# EAGLE design BBMiniPCB5x10 (EAGLE 6.6.0)
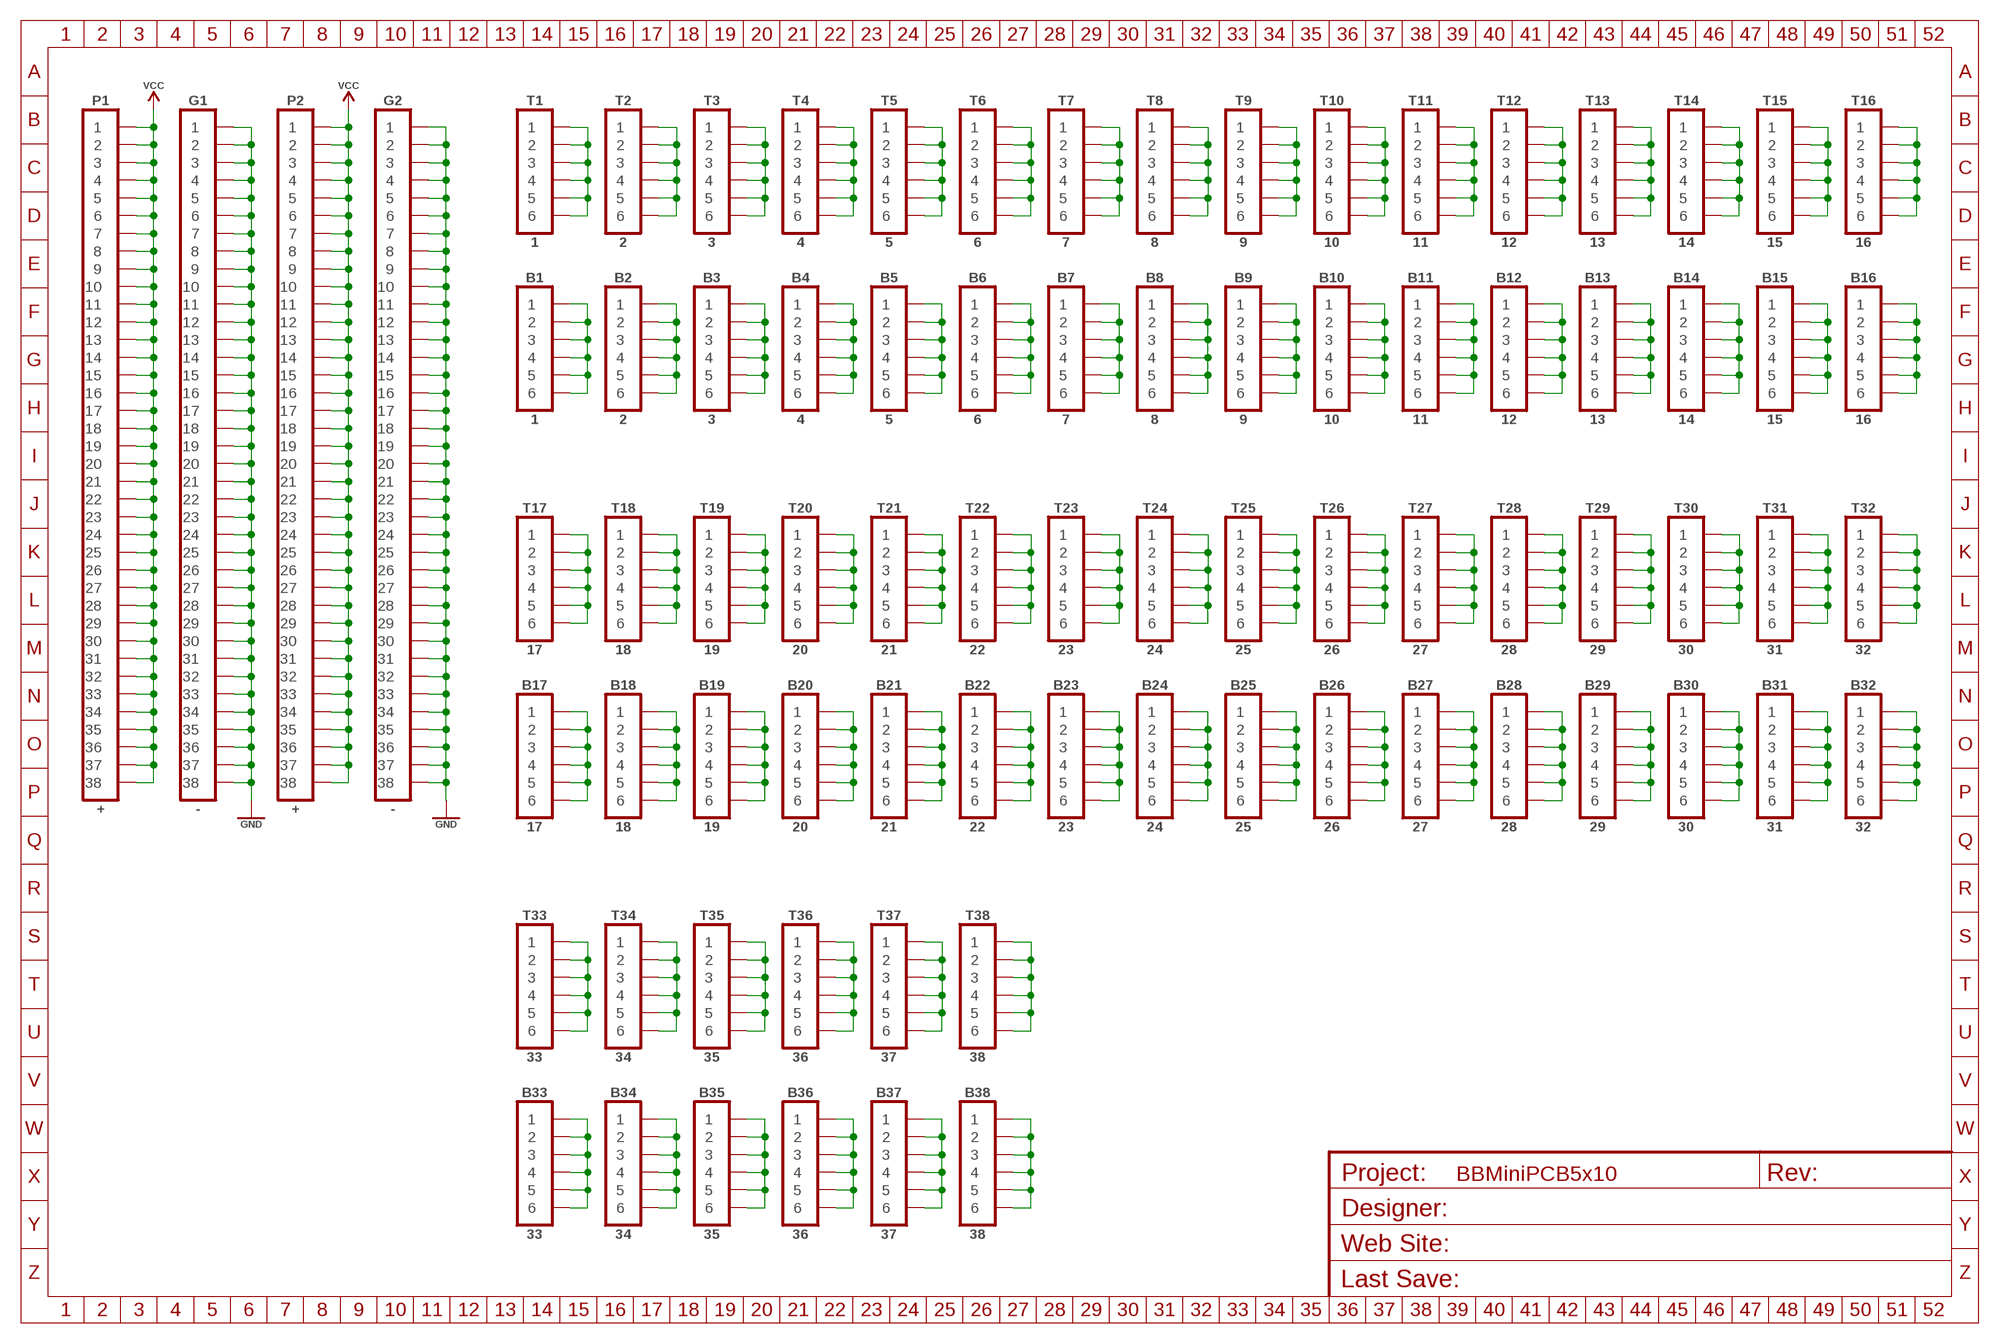
[diagram p0: schematic, sheet 1]
FRAME1 (A4L_FRAME): DESIGNER: Simon/CGTr; REVISION: 1.0; WEBSITE: http://www.commodore.gen.tr

## Parts
B1  1  HDR_1X06_NOSILK  [HDR_1X06_NOSILK]
B2  2  HDR_1X06_NOSILK  [HDR_1X06_NOSILK]
B3  3  HDR_1X06_NOSILK  [HDR_1X06_NOSILK]
B4  4  HDR_1X06_NOSILK  [HDR_1X06_NOSILK]
B5  5  HDR_1X06_NOSILK  [HDR_1X06_NOSILK]
B6  6  HDR_1X06_NOSILK  [HDR_1X06_NOSILK]
B7  7  HDR_1X06_NOSILK  [HDR_1X06_NOSILK]
B8  8  HDR_1X06_NOSILK  [HDR_1X06_NOSILK]
B9  9  HDR_1X06_NOSILK  [HDR_1X06_NOSILK]
B10  10  HDR_1X06_NOSILK  [HDR_1X06_NOSILK]
B11  11  HDR_1X06_NOSILK  [HDR_1X06_NOSILK]
B12  12  HDR_1X06_NOSILK  [HDR_1X06_NOSILK]
B13  13  HDR_1X06_NOSILK  [HDR_1X06_NOSILK]
B14  14  HDR_1X06_NOSILK  [HDR_1X06_NOSILK]
B15  15  HDR_1X06_NOSILK  [HDR_1X06_NOSILK]
B16  16  HDR_1X06_NOSILK  [HDR_1X06_NOSILK]
B17  17  HDR_1X06_NOSILK  [HDR_1X06_NOSILK]
B18  18  HDR_1X06_NOSILK  [HDR_1X06_NOSILK]
B19  19  HDR_1X06_NOSILK  [HDR_1X06_NOSILK]
B20  20  HDR_1X06_NOSILK  [HDR_1X06_NOSILK]
B21  21  HDR_1X06_NOSILK  [HDR_1X06_NOSILK]
B22  22  HDR_1X06_NOSILK  [HDR_1X06_NOSILK]
B23  23  HDR_1X06_NOSILK  [HDR_1X06_NOSILK]
B24  24  HDR_1X06_NOSILK  [HDR_1X06_NOSILK]
B25  25  HDR_1X06_NOSILK  [HDR_1X06_NOSILK]
B26  26  HDR_1X06_NOSILK  [HDR_1X06_NOSILK]
B27  27  HDR_1X06_NOSILK  [HDR_1X06_NOSILK]
B28  28  HDR_1X06_NOSILK  [HDR_1X06_NOSILK]
B29  29  HDR_1X06_NOSILK  [HDR_1X06_NOSILK]
B30  30  HDR_1X06_NOSILK  [HDR_1X06_NOSILK]
B31  31  HDR_1X06_NOSILK  [HDR_1X06_NOSILK]
B32  32  HDR_1X06_NOSILK  [HDR_1X06_NOSILK]
B33  33  HDR_1X06_NOSILK  [HDR_1X06_NOSILK]
B34  34  HDR_1X06_NOSILK  [HDR_1X06_NOSILK]
B35  35  HDR_1X06_NOSILK  [HDR_1X06_NOSILK]
B36  36  HDR_1X06_NOSILK  [HDR_1X06_NOSILK]
B37  37  HDR_1X06_NOSILK  [HDR_1X06_NOSILK]
B38  38  HDR_1X06_NOSILK  [HDR_1X06_NOSILK]
G1  -  HDR_1X38_NOSILK  [HDR_1X38_NOSILK]
G2  -  HDR_1X38_NOSILK  [HDR_1X38_NOSILK]
P1  +  HDR_1X38_NOSILK  [HDR_1X38_NOSILK]
P2  +  HDR_1X38_NOSILK  [HDR_1X38_NOSILK]
T1  1  HDR_1X06_NOSILK  [HDR_1X06_NOSILK]
T2  2  HDR_1X06_NOSILK  [HDR_1X06_NOSILK]
T3  3  HDR_1X06_NOSILK  [HDR_1X06_NOSILK]
T4  4  HDR_1X06_NOSILK  [HDR_1X06_NOSILK]
T5  5  HDR_1X06_NOSILK  [HDR_1X06_NOSILK]
T6  6  HDR_1X06_NOSILK  [HDR_1X06_NOSILK]
T7  7  HDR_1X06_NOSILK  [HDR_1X06_NOSILK]
T8  8  HDR_1X06_NOSILK  [HDR_1X06_NOSILK]
T9  9  HDR_1X06_NOSILK  [HDR_1X06_NOSILK]
T10  10  HDR_1X06_NOSILK  [HDR_1X06_NOSILK]
T11  11  HDR_1X06_NOSILK  [HDR_1X06_NOSILK]
T12  12  HDR_1X06_NOSILK  [HDR_1X06_NOSILK]
T13  13  HDR_1X06_NOSILK  [HDR_1X06_NOSILK]
T14  14  HDR_1X06_NOSILK  [HDR_1X06_NOSILK]
T15  15  HDR_1X06_NOSILK  [HDR_1X06_NOSILK]
T16  16  HDR_1X06_NOSILK  [HDR_1X06_NOSILK]
T17  17  HDR_1X06_NOSILK  [HDR_1X06_NOSILK]
T18  18  HDR_1X06_NOSILK  [HDR_1X06_NOSILK]
T19  19  HDR_1X06_NOSILK  [HDR_1X06_NOSILK]
T20  20  HDR_1X06_NOSILK  [HDR_1X06_NOSILK]
T21  21  HDR_1X06_NOSILK  [HDR_1X06_NOSILK]
T22  22  HDR_1X06_NOSILK  [HDR_1X06_NOSILK]
T23  23  HDR_1X06_NOSILK  [HDR_1X06_NOSILK]
T24  24  HDR_1X06_NOSILK  [HDR_1X06_NOSILK]
T25  25  HDR_1X06_NOSILK  [HDR_1X06_NOSILK]
T26  26  HDR_1X06_NOSILK  [HDR_1X06_NOSILK]
T27  27  HDR_1X06_NOSILK  [HDR_1X06_NOSILK]
T28  28  HDR_1X06_NOSILK  [HDR_1X06_NOSILK]
T29  29  HDR_1X06_NOSILK  [HDR_1X06_NOSILK]
T30  30  HDR_1X06_NOSILK  [HDR_1X06_NOSILK]
T31  31  HDR_1X06_NOSILK  [HDR_1X06_NOSILK]
T32  32  HDR_1X06_NOSILK  [HDR_1X06_NOSILK]
T33  33  HDR_1X06_NOSILK  [HDR_1X06_NOSILK]
T34  34  HDR_1X06_NOSILK  [HDR_1X06_NOSILK]
T35  35  HDR_1X06_NOSILK  [HDR_1X06_NOSILK]
T36  36  HDR_1X06_NOSILK  [HDR_1X06_NOSILK]
T37  37  HDR_1X06_NOSILK  [HDR_1X06_NOSILK]
T38  38  HDR_1X06_NOSILK  [HDR_1X06_NOSILK]

## Nets
B1: B1.1 B1.2 B1.3 B1.4 B1.5 B1.6
B2: B2.1 B2.2 B2.3 B2.4 B2.5 B2.6
B3: B3.1 B3.2 B3.3 B3.4 B3.5 B3.6
B4: B4.1 B4.2 B4.3 B4.4 B4.5 B4.6
B5: B5.1 B5.2 B5.3 B5.4 B5.5 B5.6
B6: B6.1 B6.2 B6.3 B6.4 B6.5 B6.6
B7: B7.1 B7.2 B7.3 B7.4 B7.5 B7.6
B8: B8.1 B8.2 B8.3 B8.4 B8.5 B8.6
B9: B9.1 B9.2 B9.3 B9.4 B9.5 B9.6
B10: B10.1 B10.2 B10.3 B10.4 B10.5 B10.6
B11: B11.1 B11.2 B11.3 B11.4 B11.5 B11.6
B12: B12.1 B12.2 B12.3 B12.4 B12.5 B12.6
B13: B13.1 B13.2 B13.3 B13.4 B13.5 B13.6
B14: B14.1 B14.2 B14.3 B14.4 B14.5 B14.6
B15: B15.1 B15.2 B15.3 B15.4 B15.5 B15.6
B16: B16.1 B16.2 B16.3 B16.4 B16.5 B16.6
B17: B17.1 B17.2 B17.3 B17.4 B17.5 B17.6
B18: B18.1 B18.2 B18.3 B18.4 B18.5 B18.6
B19: B19.1 B19.2 B19.3 B19.4 B19.5 B19.6
B20: B20.1 B20.2 B20.3 B20.4 B20.5 B20.6
B21: B21.1 B21.2 B21.3 B21.4 B21.5 B21.6
B22: B22.1 B22.2 B22.3 B22.4 B22.5 B22.6
B23: B23.1 B23.2 B23.3 B23.4 B23.5 B23.6
B24: B24.1 B24.2 B24.3 B24.4 B24.5 B24.6
B25: B25.1 B25.2 B25.3 B25.4 B25.5 B25.6
B26: B26.1 B26.2 B26.3 B26.4 B26.5 B26.6
B27: B27.1 B27.2 B27.3 B27.4 B27.5 B27.6
B28: B28.1 B28.2 B28.3 B28.4 B28.5 B28.6
B29: B29.1 B29.2 B29.3 B29.4 B29.5 B29.6
B30: B30.1 B30.2 B30.3 B30.4 B30.5 B30.6
B31: B31.1 B31.2 B31.3 B31.4 B31.5 B31.6
B32: B32.1 B32.2 B32.3 B32.4 B32.5 B32.6
B33: B33.1 B33.2 B33.3 B33.4 B33.5 B33.6
B34: B34.1 B34.2 B34.3 B34.4 B34.5 B34.6
B35: B35.1 B35.2 B35.3 B35.4 B35.5 B35.6
B36: B36.1 B36.2 B36.3 B36.4 B36.5 B36.6
B37: B37.1 B37.2 B37.3 B37.4 B37.5 B37.6
B38: B38.1 B38.2 B38.3 B38.4 B38.5 B38.6
GND: G1.1 G1.2 G1.3 G1.4 G1.5 G1.6 G1.7 G1.8 G1.9 G1.10 G1.11 G1.12 G1.13 G1.14 G1.15 G1.16 G1.17 G1.18 G1.19 G1.20 G1.21 G1.22 G1.23 G1.24 G1.25 G1.26 G1.27 G1.28 G1.29 G1.30 G1.31 G1.32 G1.33 G1.34 G1.35 G1.36 G1.37 G1.38 G2.1 G2.2 G2.3 G2.4 G2.5 G2.6 G2.7 G2.8 G2.9 G2.10 G2.11 G2.12 G2.13 G2.14 G2.15 G2.16 G2.17 G2.18 G2.19 G2.20 G2.21 G2.22 G2.23 G2.24 G2.25 G2.26 G2.27 G2.28 G2.29 G2.30 G2.31 G2.32 G2.33 G2.34 G2.35 G2.36 G2.37 G2.38
T1: T1.1 T1.2 T1.3 T1.4 T1.5 T1.6
T2: T2.1 T2.2 T2.3 T2.4 T2.5 T2.6
T3: T3.1 T3.2 T3.3 T3.4 T3.5 T3.6
T4: T4.1 T4.2 T4.3 T4.4 T4.5 T4.6
T5: T5.1 T5.2 T5.3 T5.4 T5.5 T5.6
T6: T6.1 T6.2 T6.3 T6.4 T6.5 T6.6
T7: T7.1 T7.2 T7.3 T7.4 T7.5 T7.6
T8: T8.1 T8.2 T8.3 T8.4 T8.5 T8.6
T9: T9.1 T9.2 T9.3 T9.4 T9.5 T9.6
T10: T10.1 T10.2 T10.3 T10.4 T10.5 T10.6
T11: T11.1 T11.2 T11.3 T11.4 T11.5 T11.6
T12: T12.1 T12.2 T12.3 T12.4 T12.5 T12.6
T13: T13.1 T13.2 T13.3 T13.4 T13.5 T13.6
T14: T14.1 T14.2 T14.3 T14.4 T14.5 T14.6
T15: T15.1 T15.2 T15.3 T15.4 T15.5 T15.6
T16: T16.1 T16.2 T16.3 T16.4 T16.5 T16.6
T17: T17.1 T17.2 T17.3 T17.4 T17.5 T17.6
T18: T18.1 T18.2 T18.3 T18.4 T18.5 T18.6
T19: T19.1 T19.2 T19.3 T19.4 T19.5 T19.6
T20: T20.1 T20.2 T20.3 T20.4 T20.5 T20.6
T21: T21.1 T21.2 T21.3 T21.4 T21.5 T21.6
T22: T22.1 T22.2 T22.3 T22.4 T22.5 T22.6
T23: T23.1 T23.2 T23.3 T23.4 T23.5 T23.6
T24: T24.1 T24.2 T24.3 T24.4 T24.5 T24.6
T25: T25.1 T25.2 T25.3 T25.4 T25.5 T25.6
T26: T26.1 T26.2 T26.3 T26.4 T26.5 T26.6
T27: T27.1 T27.2 T27.3 T27.4 T27.5 T27.6
T28: T28.1 T28.2 T28.3 T28.4 T28.5 T28.6
T29: T29.1 T29.2 T29.3 T29.4 T29.5 T29.6
T30: T30.1 T30.2 T30.3 T30.4 T30.5 T30.6
T31: T31.1 T31.2 T31.3 T31.4 T31.5 T31.6
T32: T32.1 T32.2 T32.3 T32.4 T32.5 T32.6
T33: T33.1 T33.2 T33.3 T33.4 T33.5 T33.6
T34: T34.1 T34.2 T34.3 T34.4 T34.5 T34.6
T35: T35.1 T35.2 T35.3 T35.4 T35.5 T35.6
T36: T36.1 T36.2 T36.3 T36.4 T36.5 T36.6
T37: T37.1 T37.2 T37.3 T37.4 T37.5 T37.6
T38: T38.1 T38.2 T38.3 T38.4 T38.5 T38.6
VCC: P1.1 P1.2 P1.3 P1.4 P1.5 P1.6 P1.7 P1.8 P1.9 P1.10 P1.11 P1.12 P1.13 P1.14 P1.15 P1.16 P1.17 P1.18 P1.19 P1.20 P1.21 P1.22 P1.23 P1.24 P1.25 P1.26 P1.27 P1.28 P1.29 P1.30 P1.31 P1.32 P1.33 P1.34 P1.35 P1.36 P1.37 P1.38 P2.1 P2.2 P2.3 P2.4 P2.5 P2.6 P2.7 P2.8 P2.9 P2.10 P2.11 P2.12 P2.13 P2.14 P2.15 P2.16 P2.17 P2.18 P2.19 P2.20 P2.21 P2.22 P2.23 P2.24 P2.25 P2.26 P2.27 P2.28 P2.29 P2.30 P2.31 P2.32 P2.33 P2.34 P2.35 P2.36 P2.37 P2.38

## Library data of the parts
B1-B38 T1-T38 = sj_connectors:HDR_1X06: 1x06 - 0.1" Pin Header
G1 G2 P1 P2 = sj_connectors:HDR_1X38: 1x38 - 0.1" Pin Header

## Board
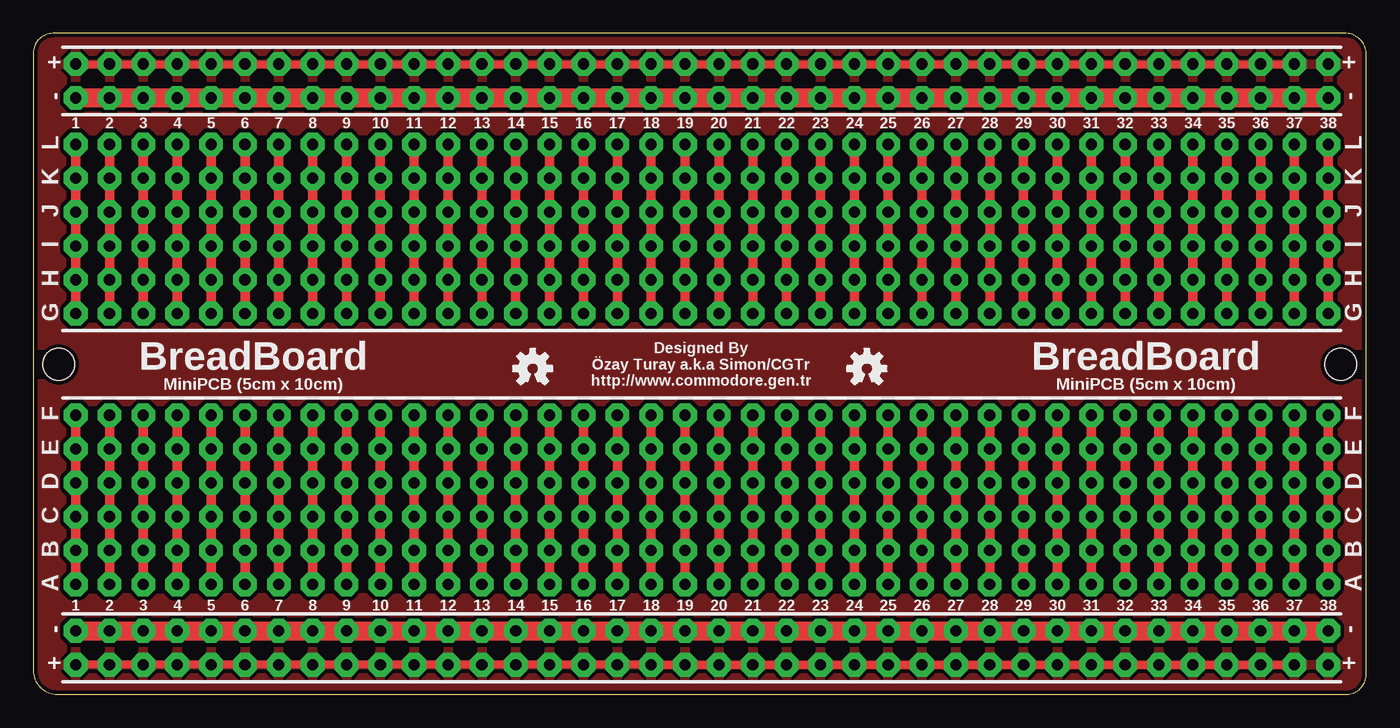
[diagram p1: board, top side]
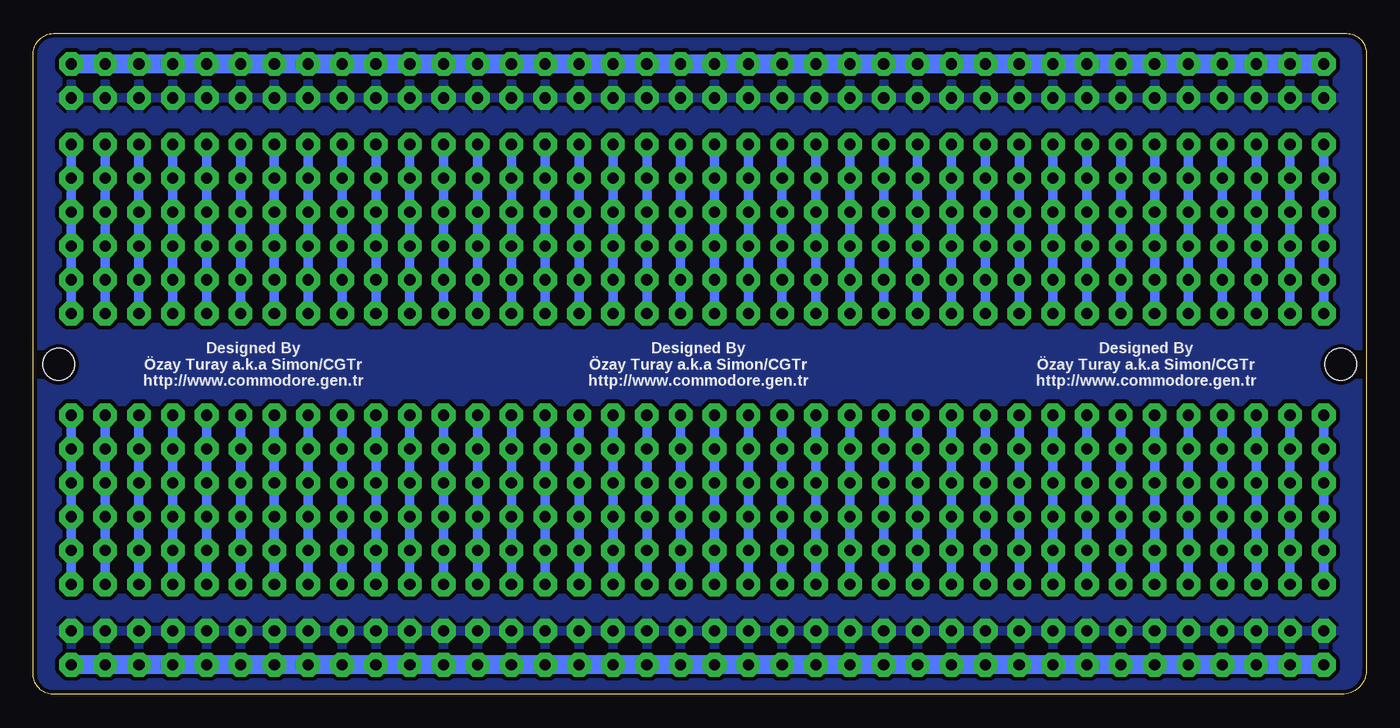
[diagram p2: board, bottom side, seen from below]

Size 100 x 49.62 mm. Coordinates in mm from the lower left corner, seen from the top.
Outline: 0,48.16 0,1.81 arc90 1.8,0.01 98.26,0.01 arc90 100,1.35 100,48.24 arc90 98.23,49.61 1.45,49.61 arc90 0,48.16
Copper layers (1*16): Top 0.035mm / dielectric 1.5mm / Bottom 0.035mm
Design rules "DirtyPCBs": minimum track width 5mil, minimum drill 12mil, track to track 5mil, track to pad 5mil, pad to pad 5mil, via to via 5mil, smd to smd 0mil, copper to edge 10mil, drill to drill 10mil, minimum pad ring 10mil, minimum via ring 6mil, stop-mask expansion 2mil, vias tented up to drill 25mil, thermal gap 10mil
Holes 2.4 mm at 1.91,24.78 98.09,24.78

### Footprints (pad centres in the part's own frame; a part is rotated, then mirrored left to right if it is on the bottom)
HDR_1X06_NOSILK = drill 0.838 pad 1.778 octagon: 1 0,0; 2 2.54,0; 3 5.08,0; 4 7.62,0; 5 10.16,0; 6 12.7,0
HDR_1X38_NOSILK = drill 0.838 pad 1.778 octagon: 1 0,0; 2 2.54,0; 3 5.08,0; 4 7.62,0; 5 10.16,0; 6 12.7,0; 7 15.24,0; 8 17.78,0; 9 20.32,0; 10 22.86,0; 11 25.4,0; 12 27.94,0; 13 30.48,0; 14 33.02,0; 15 35.56,0; 16 38.1,0; 17 40.64,0; 18 43.18,0; 19 45.72,0; 20 48.26,0; 21 50.8,0; 22 53.34,0; 23 55.88,0; 24 58.42,0; 25 60.96,0; 26 63.5,0; 27 66.04,0; 28 68.58,0; 29 71.12,0; 30 73.66,0; 31 76.2,0; 32 78.74,0; 33 81.28,0; 34 83.82,0; 35 86.36,0; 36 88.9,0; 37 91.44,0; 38 93.98,0

### Placement (x,y rotation side)
B1  3.17,8.27 90 top
B2  5.71,8.27 90 top
B3  8.26,8.27 90 top
B4  10.79,8.27 90 top
B5  13.34,8.27 90 top
B6  15.88,8.27 90 top
B7  18.41,8.27 90 top
B8  20.95,8.27 90 top
B9  23.5,8.27 90 top
B10  26.04,8.27 90 top
B11  28.57,8.27 90 top
B12  31.11,8.27 90 top
B13  33.66,8.27 90 top
B14  36.2,8.27 90 top
B15  38.73,8.27 90 top
B16  41.27,8.27 90 top
B17  43.81,8.27 90 top
B18  46.35,8.27 90 top
B19  48.9,8.27 90 top
B20  51.44,8.27 90 top
B21  53.98,8.27 90 top
B22  56.52,8.27 90 top
B23  59.05,8.27 90 top
B24  61.59,8.27 90 top
B25  64.14,8.27 90 top
B26  66.67,8.27 90 top
B27  69.22,8.27 90 top
B28  71.75,8.27 90 top
B29  74.3,8.27 90 top
B30  76.83,8.27 90 top
B31  79.38,8.27 90 top
B32  81.92,8.27 90 top
B33  84.45,8.27 90 top
B34  87,8.27 90 top
B35  89.53,8.27 90 top
B36  92.08,8.27 90 top
B37  94.61,8.27 90 top
B38  97.16,8.27 90 top
G1  3.17,4.77 0 top
G2  3.17,44.78 0 top
LOGO1  OSHW_LOGO_SMALL  [OSHW_LOGO_SMALL]  37.47,24.46 0 top
LOGO2  OSHW_LOGO_SMALL  [OSHW_LOGO_SMALL]  62.53,24.46 0 top
P1  3.17,2.23 0 top
P2  3.17,47.32 0 top
T1  3.17,41.29 270 top
T2  5.71,41.29 270 top
T3  8.26,41.29 270 top
T4  10.79,41.29 270 top
T5  13.34,41.29 270 top
T6  15.88,41.29 270 top
T7  18.41,41.29 270 top
T8  20.95,41.29 270 top
T9  23.5,41.29 270 top
T10  26.04,41.29 270 top
T11  28.57,41.29 270 top
T12  31.11,41.29 270 top
T13  33.66,41.29 270 top
T14  36.2,41.29 270 top
T15  38.73,41.29 270 top
T16  41.27,41.29 270 top
T17  43.81,41.29 270 top
T18  46.35,41.29 270 top
T19  48.9,41.29 270 top
T20  51.44,41.29 270 top
T21  53.98,41.29 270 top
T22  56.52,41.29 270 top
T23  59.05,41.29 270 top
T24  61.59,41.29 270 top
T25  64.14,41.29 270 top
T26  66.67,41.29 270 top
T27  69.22,41.29 270 top
T28  71.75,41.29 270 top
T29  74.3,41.29 270 top
T30  76.83,41.29 270 top
T31  79.38,41.29 270 top
T32  81.92,41.29 270 top
T33  84.45,41.29 270 top
T34  87,41.29 270 top
T35  89.53,41.29 270 top
T36  92.08,41.29 270 top
T37  94.61,41.29 270 top
T38  97.16,41.29 270 top

### Tracks (layer width: path | path; a pad name or v marks a point on that pad's centre or on a via)
B1
  Top 0.711: B1.1 B1.2 B1.3 B1.4 B1.5 B1.6
  Bottom 0.711: B1.1 B1.6
B2
  Top 0.711: B2.6 B2.5 B2.4 B2.3 B2.2 B2.1
  Bottom 0.711: B2.1 B2.6
B3
  Top 0.711: B3.1 B3.2 B3.3 B3.4 B3.5 B3.6
  Bottom 0.711: B3.6 B3.1
B4
  Top 0.711: B4.6 B4.5 B4.4 B4.3 B4.2 B4.1
  Bottom 0.711: B4.1 B4.6
B5
  Top 0.711: B5.1 B5.2 B5.3 B5.4 B5.5 B5.6
  Bottom 0.711: B5.6 B5.1
B6
  Top 0.711: B6.6 B6.5 B6.4 B6.3 B6.2 B6.1
  Bottom 0.711: B6.1 B6.6
B7
  Top 0.711: B7.1 B7.2 B7.3 B7.4 B7.5 B7.6
  Bottom 0.711: B7.6 B7.1
B8
  Top 0.711: B8.6 B8.5 B8.4 B8.3 B8.2 B8.1
  Bottom 0.711: B8.1 B8.6
B9
  Top 0.711: B9.1 B9.2 B9.3 B9.4 B9.5 B9.6
  Bottom 0.711: B9.6 B9.1
B10
  Top 0.711: B10.6 B10.5 B10.4 B10.3 B10.2 B10.1
  Bottom 0.711: B10.1 B10.6
B11
  Top 0.711: B11.1 B11.2 B11.3 B11.4 B11.5 B11.6
  Bottom 0.711: B11.6 B11.1
B12
  Top 0.711: B12.6 B12.5 B12.4 B12.3 B12.2 B12.1
  Bottom 0.711: B12.1 B12.6
B13
  Top 0.711: B13.1 B13.2 B13.3 B13.4 B13.5 B13.6
  Bottom 0.711: B13.6 B13.1
B14
  Top 0.711: B14.6 B14.5 B14.4 B14.3 B14.2 B14.1
  Bottom 0.711: B14.1 B14.6
B15
  Top 0.711: B15.1 B15.2 B15.3 B15.4 B15.5 B15.6
  Bottom 0.711: B15.6 B15.1
B16
  Top 0.711: B16.6 B16.5 B16.4 B16.3 B16.2 B16.1
  Bottom 0.711: B16.1 B16.6
B17
  Top 0.711: B17.1 B17.2 B17.3 B17.4 B17.5 B17.6
  Bottom 0.711: B17.6 B17.1
B18
  Top 0.711: B18.6 B18.5 B18.4 B18.3 B18.2 B18.1
  Bottom 0.711: B18.1 B18.6
B19
  Top 0.711: B19.1 B19.2 B19.3 B19.4 B19.5 B19.6
  Bottom 0.711: B19.1 B19.6
B20
  Top 0.711: B20.6 B20.5 B20.4 B20.3 B20.2 B20.1
  Bottom 0.711: B20.6 B20.1
B21
  Top 0.711: B21.1 B21.2 B21.3 B21.4 B21.5 B21.6
  Bottom 0.711: B21.1 B21.6
B22
  Top 0.711: B22.6 B22.5 B22.4 B22.3 B22.2 B22.1
  Bottom 0.711: B22.6 B22.1
B23
  Top 0.711: B23.1 B23.2 B23.3 B23.4 B23.5 B23.6
  Bottom 0.711: B23.1 B23.6
B24
  Top 0.711: B24.6 B24.5 B24.4 B24.3 B24.2 B24.1
  Bottom 0.711: B24.6 B24.1
B25
  Top 0.711: B25.1 B25.2 B25.3 B25.4 B25.5 B25.6
  Bottom 0.711: B25.1 B25.6
B26
  Top 0.711: B26.6 B26.5 B26.4 B26.3 B26.2 B26.1
  Bottom 0.711: B26.6 B26.1
B27
  Top 0.711: B27.6 B27.5 B27.4 B27.3 B27.2 B27.1
  Bottom 0.711: B27.1 B27.6
B28
  Top 0.711: B28.1 B28.2 B28.3 B28.4 B28.5 B28.6
  Bottom 0.711: B28.6 B28.1
B29
  Top 0.711: B29.6 B29.5 B29.4 B29.3 B29.2 B29.1
  Bottom 0.711: B29.1 B29.6
B30
  Top 0.711: B30.1 B30.2 B30.3 B30.4 B30.5 B30.6
  Bottom 0.711: B30.6 B30.1
B31
  Top 0.711: B31.6 B31.5 B31.4 B31.3 B31.2 B31.1
  Bottom 0.711: B31.1 B31.6
B32
  Top 0.711: B32.1 B32.2 B32.3 B32.4 B32.5 B32.6
  Bottom 0.711: B32.6 B32.1
B33
  Top 0.711: B33.6 B33.5 B33.4 B33.3 B33.2 B33.1
  Bottom 0.711: B33.1 B33.6
B34
  Top 0.711: B34.1 B34.2 B34.3 B34.4 B34.5 B34.6
  Bottom 0.711: B34.6 B34.1
B35
  Top 0.711: B35.6 B35.5 B35.4 B35.3 B35.2 B35.1
  Bottom 0.711: B35.1 B35.6
B36
  Top 0.711: B36.1 B36.2 B36.3 B36.4 B36.5 B36.6
  Bottom 0.711: B36.6 B36.1
B37
  Top 0.711: B37.6 B37.5 B37.4 B37.3 B37.2 B37.1
  Bottom 0.711: B37.1 B37.6
B38
  Top 0.711: B38.1 B38.2 B38.3 B38.4 B38.5 B38.6
  Bottom 0.711: B38.6 B38.1
GND
  Top 1.422: G2.1 96.84,44.78 | G1.1 G1.38
  pour Bottom (isolate 0.305): 0,49.61 0,0.01 100,0.01 100,49.61
T1
  Top 0.711: T1.6 T1.5 T1.4 T1.3 T1.2 T1.1
  Bottom 0.711: T1.1 T1.6
T2
  Top 0.711: T2.1 T2.2 T2.3 T2.4 T2.5 T2.6
  Bottom 0.711: T2.6 T2.1
T3
  Top 0.711: T3.6 T3.5 T3.4 T3.3 T3.2 T3.1
  Bottom 0.711: T3.1 T3.6
T4
  Top 0.711: T4.1 T4.2 T4.3 T4.4 T4.5 T4.6
  Bottom 0.711: T4.6 T4.1
T5
  Top 0.711: T5.6 T5.5 T5.4 T5.3 T5.2 T5.1
  Bottom 0.711: T5.1 T5.6
T6
  Top 0.711: T6.1 T6.2 T6.3 T6.4 T6.5 T6.6
  Bottom 0.711: T6.6 T6.1
T7
  Top 0.711: T7.6 T7.5 T7.4 T7.3 T7.2 T7.1
  Bottom 0.711: T7.1 T7.6
T8
  Top 0.711: T8.1 T8.2 T8.3 T8.4 T8.5 T8.6
  Bottom 0.711: T8.6 T8.1
T9
  Top 0.711: T9.6 T9.5 T9.4 T9.3 T9.2 T9.1
  Bottom 0.711: T9.1 T9.6
T10
  Top 0.711: T10.1 T10.2 T10.3 T10.4 T10.5 T10.6
  Bottom 0.711: T10.6 T10.1
T11
  Top 0.711: T11.6 T11.5 T11.4 T11.3 T11.2 T11.1
  Bottom 0.711: T11.1 T11.6
T12
  Top 0.711: T12.1 T12.2 T12.3 T12.4 T12.5 T12.6
  Bottom 0.711: T12.6 T12.1
T13
  Top 0.711: T13.6 T13.5 T13.4 T13.3 T13.2 T13.1
  Bottom 0.711: T13.1 T13.6
T14
  Top 0.711: T14.1 T14.2 T14.3 T14.4 T14.5 T14.6
  Bottom 0.711: T14.6 T14.1
T15
  Top 0.711: T15.6 T15.5 T15.4 T15.3 T15.2 T15.1
  Bottom 0.711: T15.1 T15.6
T16
  Top 0.711: T16.1 T16.2 T16.3 T16.4 T16.5 T16.6
  Bottom 0.711: T16.6 T16.1
T17
  Top 0.711: T17.6 T17.5 T17.4 T17.3 T17.2 T17.1
  Bottom 0.711: T17.1 T17.6
T18
  Top 0.711: T18.6 T18.5 T18.4 T18.3 T18.2 T18.1
  Bottom 0.711: T18.6 T18.1
T19
  Top 0.711: T19.1 T19.2 T19.3 T19.4 | 48.9,33.98 T19.5 T19.6
  Bottom 0.711: T19.1 T19.6
T20
  Top 0.711: T20.6 T20.5 T20.4 T20.3 T20.2 T20.1
  Bottom 0.711: T20.6 T20.1
T21
  Top 0.711: T21.1 T21.2 T21.3 T21.4 T21.5 T21.6
  Bottom 0.711: T21.1 T21.6
T22
  Top 0.711: T22.6 T22.5 T22.4 T22.3 T22.2 T22.1
  Bottom 0.711: T22.6 T22.1
T23
  Top 0.711: T23.1 T23.2 T23.3 T23.4 T23.5 T23.6
  Bottom 0.711: T23.1 T23.6
T24
  Top 0.711: T24.6 T24.5 T24.4 T24.3 T24.2 T24.1
  Bottom 0.711: T24.6 T24.1
T25
  Top 0.711: T25.1 T25.2 T25.3 T25.4 T25.5 T25.6
  Bottom 0.711: T25.1 T25.6
T26
  Top 0.711: T26.6 T26.5 T26.4 T26.3 T26.2 T26.1
  Bottom 0.711: T26.6 T26.1
T27
  Top 0.711: T27.1 T27.2 T27.3 T27.4 T27.5 T27.6
  Bottom 0.711: T27.1 T27.6
T28
  Top 0.711: T28.6 T28.5 T28.4 T28.3 T28.2 T28.1
  Bottom 0.711: T28.6 T28.1
T29
  Top 0.711: T29.1 T29.2 T29.3 T29.4 T29.5 T29.6
  Bottom 0.711: T29.1 T29.6
T30
  Top 0.711: T30.6 T30.5 T30.4 T30.3 T30.2 T30.1
  Bottom 0.711: T30.6 T30.1
T31
  Top 0.711: T31.1 T31.2 T31.3 T31.4 T31.5 T31.6
  Bottom 0.711: T31.1 T31.6
T32
  Top 0.711: T32.6 T32.5 T32.4 T32.3 T32.2 T32.1
  Bottom 0.711: T32.6 T32.1
T33
  Top 0.711: T33.1 T33.2 T33.3 T33.4 T33.5 T33.6
  Bottom 0.711: T33.1 T33.6
T34
  Top 0.711: T34.6 T34.5 T34.4 T34.3 T34.2 T34.1
  Bottom 0.711: T34.6 T34.1
T35
  Top 0.711: T35.1 T35.2 T35.3 T35.4 T35.5 T35.6
  Bottom 0.711: T35.1 T35.6
T36
  Top 0.711: T36.6 T36.5 T36.4 T36.3 T36.2 T36.1
  Bottom 0.711: T36.6 T36.1
T37
  Top 0.711: T37.1 T37.2 T37.3 T37.4 T37.5 T37.6
  Bottom 0.711: T37.1 T37.6
T38
  Top 0.711: T38.6 T38.5 T38.4 T38.3 T38.2 T38.1
  Bottom 0.711: T38.6 T38.1
VCC
  Top 0.61: P2.1 P2.2 P2.3 P2.4 P2.5 P2.6 P2.7 P2.8 P2.9 P2.10 P2.11 P2.12 P2.13 P2.14 P2.15 P2.16 P2.17 P2.18 P2.19 P2.20 P2.21 P2.22 P2.23 P2.24 P2.25 P2.26 P2.27 P2.28 P2.29 P2.30 P2.31 P2.32 P2.33 P2.34 P2.35 P2.36 P2.37 | P1.1 P1.2 P1.3 P1.4 P1.5 P1.6 P1.7 P1.8 P1.9 P1.10 P1.11 P1.12 P1.13 P1.14 P1.15 P1.16 P1.17 P1.18 P1.19 P1.20 P1.21 P1.22 P1.23 P1.24 P1.25 P1.26 P1.27 P1.28 P1.29 P1.30 P1.31 P1.32 P1.33 P1.34 P1.35 P1.36 P1.37
  Bottom 1.422: P2.1 P2.38 | P1.1 P1.38
  pour Top (isolate 0.305): 0,49.61 0,0.01 100,0.01 100,49.61

### Text on the board
tPlace: + | - | L | L | K | K | J | J | I | I | H | H | G | G | BreadBoard | Designed By / Özay Turay a.k.a Simon/CGTr / http://www.commodore.gen.tr | BreadBoard | MiniPCB (5cm x 10cm) | MiniPCB (5cm x 10cm) | F | F | E | E | D | D | C | C | B | B | A | A | - | +
bPlace: Designed By / Özay Turay a.k.a Simon/CGTr / http://www.commodore.gen.tr | Designed By / Özay Turay a.k.a Simon/CGTr / http://www.commodore.gen.tr | Designed By / Özay Turay a.k.a Simon/CGTr / http://www.commodore.gen.tr